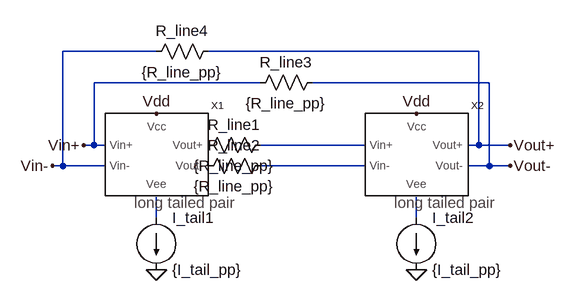
[diagram p0: schematic differential_ring_oscillator.asc]
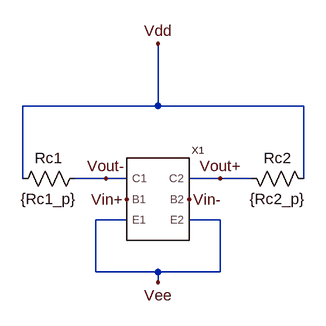
[diagram p1: sub-circuit long_tailed_pair.asc]
differential_ring_oscillator.asc, the LTspice schematic file:
Version 4.1
SHEET 1 1468 680
WIRE 224 -48 80 -48
WIRE 720 -48 304 -48
WIRE 384 0 128 0
WIRE 736 0 464 0
WIRE 128 96 128 0
WIRE 128 96 112 96
WIRE 144 96 128 96
WIRE 544 96 384 96
WIRE 720 96 720 -48
WIRE 720 96 704 96
WIRE 768 96 720 96
WIRE 80 128 80 -48
WIRE 80 128 64 128
WIRE 144 128 80 128
WIRE 544 128 384 128
WIRE 736 128 736 0
WIRE 736 128 704 128
WIRE 768 128 736 128
WIRE 224 208 224 176
WIRE 624 208 624 176
FLAG 224 48 Vdd
FLAG 224 288 0
FLAG 112 96 Vin+
FLAG 64 128 Vin-
FLAG 624 288 0
FLAG 768 96 Vout+
FLAG 768 128 Vout-
FLAG 624 48 Vdd
SYMBOL long_tailed_pair 224 112 R0
SYMATTR InstName X1
SYMATTR SpiceLine Rc1_p={Rc1_pp} Rc2_p={Rc2_pp}
SYMBOL current 224 208 R0
WINDOW 123 0 0 Left 0
WINDOW 39 0 0 Left 0
SYMATTR InstName I_tail1
SYMATTR Value {I_tail_pp}
SYMBOL long_tailed_pair 624 112 R0
SYMATTR InstName X2
SYMATTR SpiceLine Rc1_p={Rc1_pp} Rc2_p={Rc2_pp}
SYMBOL res 400 80 R90
WINDOW 0 0 56 VBottom 0
WINDOW 3 32 56 VTop 0
SYMATTR InstName R_line1
SYMATTR Value {R_line_pp}
SYMBOL res 400 112 R90
WINDOW 0 0 56 VBottom 0
WINDOW 3 32 56 VTop 0
SYMATTR InstName R_line2
SYMATTR Value {R_line_pp}
SYMBOL res 480 -16 R90
WINDOW 0 0 56 VBottom 0
WINDOW 3 32 56 VTop 0
SYMATTR InstName R_line3
SYMATTR Value {R_line_pp}
SYMBOL res 320 -64 R90
WINDOW 0 0 56 VBottom 0
WINDOW 3 32 56 VTop 0
SYMATTR InstName R_line4
SYMATTR Value {R_line_pp}
SYMBOL current 624 208 R0
WINDOW 123 0 0 Left 0
WINDOW 39 0 0 Left 0
SYMATTR InstName I_tail2
SYMATTR Value {I_tail_pp}

long_tailed_pair.asc, the sub-circuit schematic file:
Version 4.1
SHEET 1 1140 680
WIRE 208 32 208 -64
WIRE 208 32 0 32
WIRE 432 32 208 32
WIRE 0 144 0 32
WIRE 128 144 80 144
WIRE 160 144 128 144
WIRE 304 144 256 144
WIRE 352 144 304 144
WIRE 432 144 432 32
WIRE 160 208 112 208
WIRE 304 208 256 208
WIRE 112 288 112 208
WIRE 208 288 112 288
WIRE 304 288 304 208
WIRE 304 288 208 288
WIRE 208 304 208 288
FLAG 208 -64 Vdd
FLAG 160 176 Vin+
FLAG 256 176 Vin-
FLAG 208 304 Vee
FLAG 128 144 Vout-
FLAG 304 144 Vout+
SYMBOL res 96 128 R90
WINDOW 0 0 56 VBottom 2
WINDOW 3 32 56 VTop 2
SYMATTR InstName Rc1
SYMATTR Value {Rc1_p}
SYMBOL res 336 128 M90
WINDOW 0 0 56 VBottom 2
WINDOW 3 32 56 VTop 2
SYMATTR InstName Rc2
SYMATTR Value {Rc2_p}
SYMBOL BCM847BS_pair 224 176 R0
SYMATTR InstName X1

The netlist it stands for:
* differential_ring_oscillator.asc
X§X1 Vdd Vin+ Vin- N003 P001 P002 long_tailed_pair params: Rc1_p={Rc1_pp} Rc2_p={Rc2_pp}
I_tail1 N003 0 {I_tail_pp}
X§X2 Vdd N001 N002 N004 Vout+ Vout- long_tailed_pair params: Rc1_p={Rc1_pp} Rc2_p={Rc2_pp}
R_line1 N001 P001 {R_line_pp}
R_line2 N002 P002 {R_line_pp}
R_line3 Vout- Vin+ {R_line_pp}
R_line4 Vout+ Vin- {R_line_pp}
I_tail2 N004 0 {I_tail_pp}

* block symbol definitions
.subckt long_tailed_pair Vcc Vin+ Vin- Vee Vout+ Vout-
Rc1 Vout- Vdd {Rc1_p}
Rc2 Vout+ Vdd {Rc2_p}
X§X1 Vout- Vin+ Vee Vout+ Vin- Vee BCM847BS_pair  ; pins C1 B1 E1 C2 B2 E2
.ends long_tailed_pair

.backanno
.end